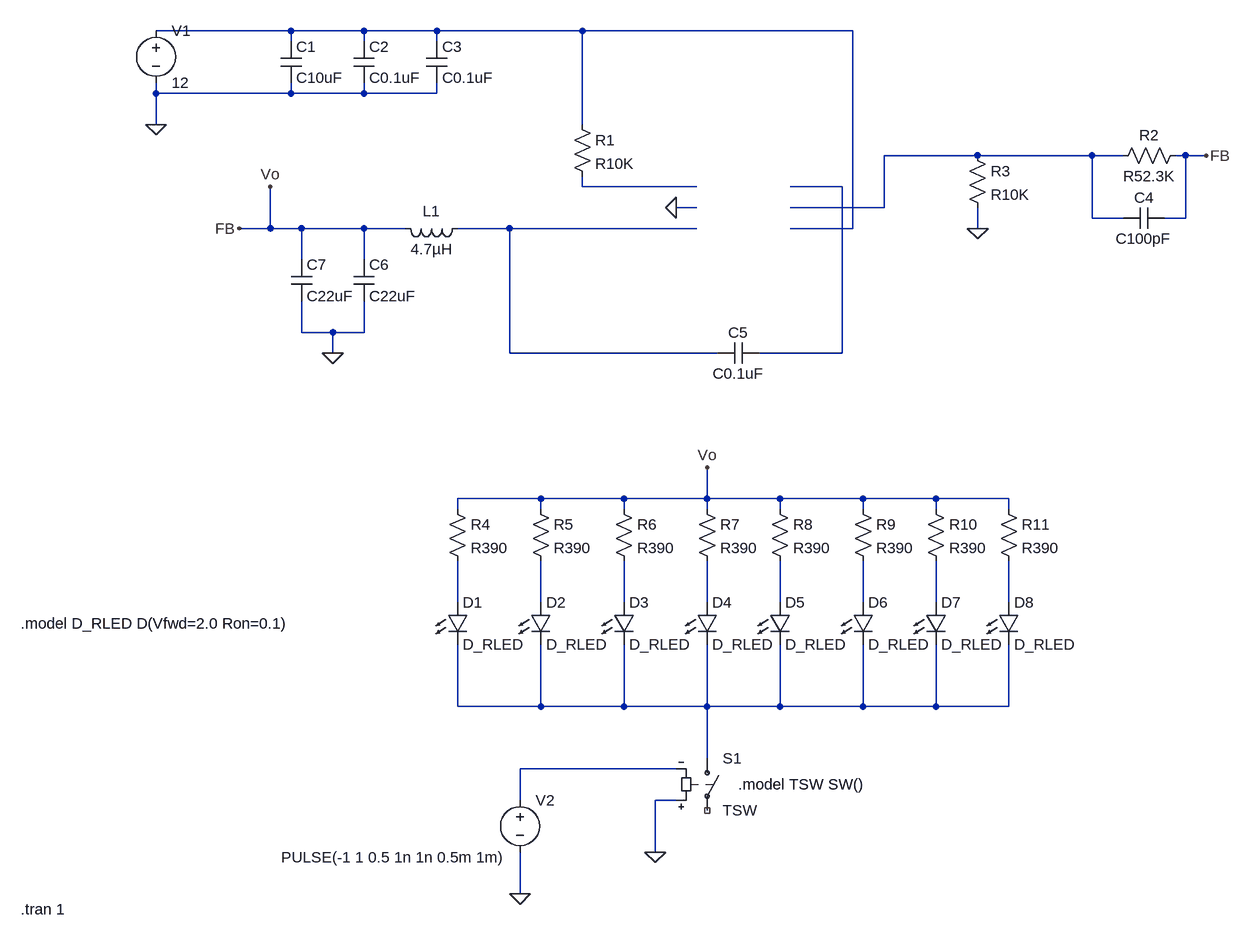
[diagram p0: schematic Power_rail_transients.asc]
Power_rail_transients.asc, the LTspice schematic file:
Version 4.1
SHEET 1 992 1272
WIRE -464 -96 -672 -96
WIRE -352 -96 -464 -96
WIRE -240 -96 -352 -96
WIRE -16 -96 -240 -96
WIRE 400 -96 -16 -96
WIRE -464 -80 -464 -96
WIRE -352 -80 -352 -96
WIRE -240 -80 -240 -96
WIRE -672 0 -672 -16
WIRE -464 0 -464 -16
WIRE -464 0 -672 0
WIRE -352 0 -352 -16
WIRE -352 0 -464 0
WIRE -240 0 -240 -16
WIRE -240 0 -352 0
WIRE -672 48 -672 0
WIRE -16 48 -16 -96
WIRE 592 96 448 96
WIRE 768 96 592 96
WIRE 816 96 768 96
WIRE 912 96 896 96
WIRE 944 96 912 96
WIRE -16 144 -16 128
WIRE 160 144 -16 144
WIRE 384 144 304 144
WIRE 160 176 128 176
WIRE 448 176 448 96
WIRE 448 176 304 176
WIRE 768 192 768 96
WIRE 816 192 768 192
WIRE 912 192 912 96
WIRE 912 192 880 192
WIRE -496 208 -496 144
WIRE -496 208 -544 208
WIRE -448 208 -496 208
WIRE -352 208 -448 208
WIRE -288 208 -352 208
WIRE -128 208 -208 208
WIRE 160 208 -128 208
WIRE 400 208 400 -96
WIRE 400 208 304 208
WIRE 592 208 592 176
WIRE -448 256 -448 208
WIRE -352 256 -352 208
WIRE -448 368 -448 320
WIRE -400 368 -448 368
WIRE -352 368 -352 320
WIRE -352 368 -400 368
WIRE -400 400 -400 368
WIRE -128 400 -128 208
WIRE 192 400 -128 400
WIRE 384 400 384 144
WIRE 384 400 256 400
WIRE -80 624 -208 624
WIRE 48 624 -80 624
WIRE 176 624 176 576
WIRE 176 624 48 624
WIRE 288 624 176 624
WIRE 416 624 288 624
WIRE 528 624 416 624
WIRE 640 624 528 624
WIRE -208 640 -208 624
WIRE -80 640 -80 624
WIRE 48 640 48 624
WIRE 176 640 176 624
WIRE 288 640 288 624
WIRE 416 640 416 624
WIRE 528 640 528 624
WIRE 640 640 640 624
WIRE -208 784 -208 720
WIRE -80 784 -80 720
WIRE 48 784 48 720
WIRE 176 784 176 720
WIRE 288 784 288 720
WIRE 416 784 416 720
WIRE 528 784 528 720
WIRE 640 784 640 720
WIRE -208 944 -208 848
WIRE -80 944 -80 848
WIRE -80 944 -208 944
WIRE 48 944 48 848
WIRE 48 944 -80 944
WIRE 176 944 176 848
WIRE 176 944 48 944
WIRE 288 944 288 848
WIRE 288 944 176 944
WIRE 416 944 416 848
WIRE 416 944 288 944
WIRE 528 944 528 848
WIRE 528 944 416 944
WIRE 640 944 640 848
WIRE 640 944 528 944
WIRE 176 1024 176 944
WIRE 128 1040 -112 1040
WIRE -112 1088 -112 1040
WIRE 128 1088 96 1088
WIRE 96 1168 96 1088
WIRE -112 1232 -112 1168
FLAG -672 48 0
FLAG 128 176 0
FLAG 944 96 FB
FLAG 592 208 0
FLAG -400 400 0
FLAG -544 208 FB
FLAG -496 144 Vo
FLAG -112 1232 0
FLAG 96 1168 0
FLAG 176 576 Vo
SYMBOL cap -480 -80 R0
SYMATTR InstName C1
SYMATTR Value C10uF
SYMBOL cap -368 -80 R0
SYMATTR InstName C2
SYMATTR Value C0.1uF
SYMBOL cap -256 -80 R0
SYMATTR InstName C3
SYMATTR Value C0.1uF
SYMBOL voltage -672 -112 R0
WINDOW 123 0 0 Left 0
WINDOW 39 0 0 Left 0
SYMATTR InstName V1
SYMATTR Value 12
SYMBOL res -32 32 R0
SYMATTR InstName R1
SYMATTR Value R10K
SYMBOL cap 880 176 R90
WINDOW 0 0 32 VBottom 2
WINDOW 3 32 32 VTop 2
SYMATTR InstName C4
SYMATTR Value C100pF
SYMBOL res 912 80 R90
WINDOW 0 0 56 VBottom 2
WINDOW 3 32 56 VTop 2
SYMATTR InstName R2
SYMATTR Value R52.3K
SYMBOL cap 256 384 R90
WINDOW 0 0 32 VBottom 2
WINDOW 3 32 32 VTop 2
SYMATTR InstName C5
SYMATTR Value C0.1uF
SYMBOL res 576 80 R0
SYMATTR InstName R3
SYMATTR Value R10K
SYMBOL ind -192 192 R90
WINDOW 0 5 56 VBottom 2
WINDOW 3 32 56 VTop 2
SYMATTR InstName L1
SYMATTR Value 4.7µH
SYMATTR SpiceLine Rser=1m
SYMBOL cap -368 256 R0
SYMATTR InstName C6
SYMATTR Value C22uF
SYMBOL cap -464 256 R0
SYMATTR InstName C7
SYMATTR Value C22uF
SYMBOL res -224 624 R0
SYMATTR InstName R4
SYMATTR Value R390
SYMBOL res -96 624 R0
SYMATTR InstName R5
SYMATTR Value R390
SYMBOL res 32 624 R0
SYMATTR InstName R6
SYMATTR Value R390
SYMBOL res 160 624 R0
SYMATTR InstName R7
SYMATTR Value R390
SYMBOL res 272 624 R0
SYMATTR InstName R8
SYMATTR Value R390
SYMBOL res 400 624 R0
SYMATTR InstName R9
SYMATTR Value R390
SYMBOL res 512 624 R0
SYMATTR InstName R10
SYMATTR Value R390
SYMBOL res 624 624 R0
SYMATTR InstName R11
SYMATTR Value R390
SYMBOL sw 176 1008 R0
SYMATTR InstName S1
SYMATTR Value TSW
SYMBOL voltage -112 1072 R0
WINDOW 3 -367 104 Left 2
SYMATTR Value PULSE(-1 1 0.5 1n 1n 0.5m 1m)
SYMATTR InstName V2
SYMBOL LED -224 784 R0
SYMATTR InstName D1
SYMATTR Value D_RLED
SYMBOL LED -96 784 R0
SYMATTR InstName D2
SYMATTR Value D_RLED
SYMBOL LED 32 784 R0
SYMATTR InstName D3
SYMATTR Value D_RLED
SYMBOL LED 160 784 R0
SYMATTR InstName D4
SYMATTR Value D_RLED
SYMBOL LED 272 784 R0
SYMATTR InstName D5
SYMATTR Value D_RLED
SYMBOL LED 400 784 R0
SYMATTR InstName D6
SYMATTR Value D_RLED
SYMBOL LED 512 784 R0
SYMATTR InstName D7
SYMATTR Value D_RLED
SYMBOL LED 624 784 R0
SYMATTR InstName D8
SYMATTR Value D_RLED
TEXT 224 1064 Left 2 !.model TSW SW()
TEXT -880 816 Left 2 !.model D_RLED D(Vfwd=2.0 Ron=0.1)
TEXT -880 1256 Left 2 !.tran 1

The netlist it stands for:
* Power_rail_transients.asc
C1 N001 0 C10uF
C2 N001 0 C0.1uF
C3 N001 0 C0.1uF
V1 N001 0 12
R1 N001 N003 R10K
C4 Vo N002 C100pF
R2 Vo N002 R52.3K
C5 N004 N005 C0.1uF
R3 N002 0 R10K
L1 N005 Vo 4.7µH Rser=1m
C6 Vo 0 C22uF
C7 Vo 0 C22uF
R4 Vo N006 R390
R5 Vo N007 R390
R6 Vo N008 R390
R7 Vo N009 R390
R8 Vo N010 R390
R9 Vo N011 R390
R10 Vo N012 R390
R11 Vo N013 R390
S1 N014 NC_01 0 N015 TSW
V2 N015 0 PULSE(-1 1 0.5 1n 1n 0.5m 1m)
D1 N006 N014 D_RLED
D2 N007 N014 D_RLED
D3 N008 N014 D_RLED
D4 N009 N014 D_RLED
D5 N010 N014 D_RLED
D6 N011 N014 D_RLED
D7 N012 N014 D_RLED
D8 N013 N014 D_RLED
.model D D
.lib standard.dio
.model TSW SW()
.model D_RLED D(Vfwd=2.0 Ron=0.1)
.tran 1
.backanno
.end